# EAGLE design Debugger_1 (EAGLE 9.6.2)
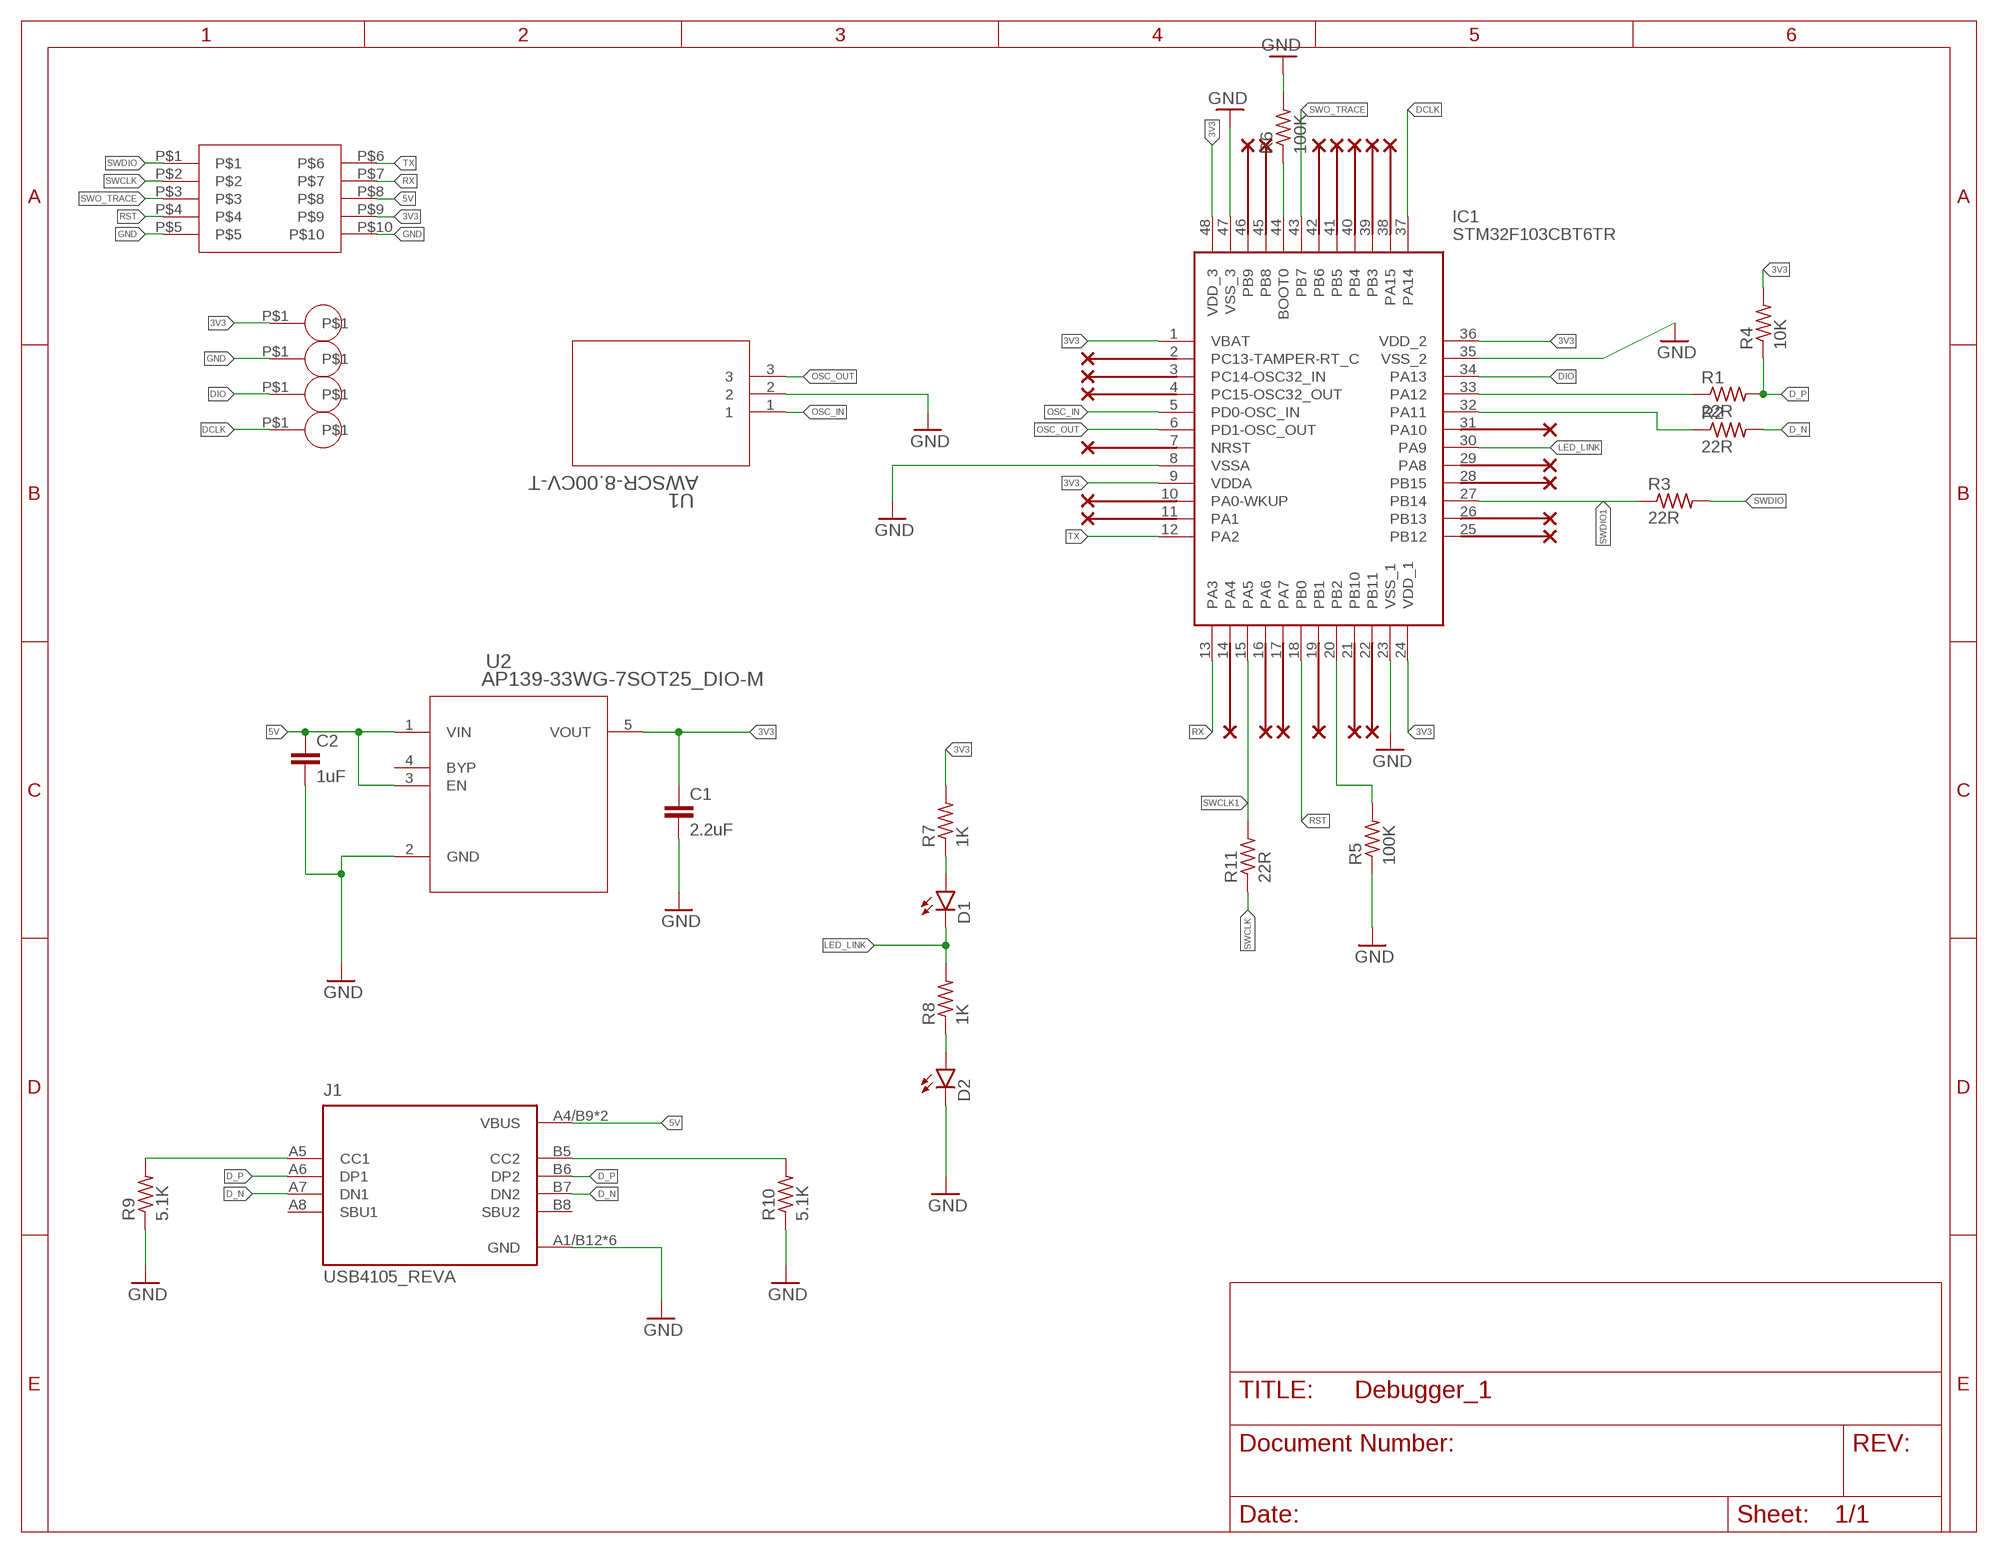
[diagram p0: schematic, sheet 1]

## Parts
C1  2.2uF  C-EUC0603  [C0603]
C2  1uF  C-EUC0603  [C0603]
D1  LEDCHIPLED_0603  [CHIPLED_0603]
D2  LEDCHIPLED_0603  [CHIPLED_0603]
IC1  STM32F103CBT6TR  [QFP50P900X900X160-48N]
J1  USB4105_REVA  [GCT_USB4105_REVA]
R1  22R  R-US_R0603  [R0603]
R2  22R  R-US_R0603  [R0603]
R3  22R  R-US_R0603  [R0603]
R4  10K  R-US_R0603  [R0603]
R5  100K  R-US_R0603  [R0603]
R6  100K  R-US_R0603  [R0603]
R7  1K  R-US_R0603  [R0603]
R8  1K  R-US_R0603  [R0603]
R9  5.1K  R-US_R0603  [R0603]
R10  5.1K  R-US_R0603  [R0603]
R11  22R  R-US_R0603  [R0603]
U1  AWSCR-8.00CV-T  [AWSCR-8.00CV-T_ABR]
U2  AP139-33WG-7SOT25_DIO-M  [SOT25_DIO-M]
U$25  SIDEWAYS_HEADER_10  [SIDEWAYS_HEADER_10]
U$26  SPRING_PAD_1  [SPRING_PAD_1]
U$27  SPRING_PAD_1  [SPRING_PAD_1]
U$28  SPRING_PAD_1  [SPRING_PAD_1]
U$29  SPRING_PAD_1  [SPRING_PAD_1]

## Nets
3V3: C1.1 IC1.1(VBAT) IC1.9(VDDA) IC1.24(VDD_1) IC1.36(VDD_2) IC1.48(VDD_3) R4.2 R7.2 U2.5(VOUT) U$25.P$9 U$26.P$1
5V: C2.1 J1.A4/B9(VBUS) J1.B4/A9(VBUS) U2.1(VIN) U2.3(EN) U$25.P$8
D_N: J1.A7(DN1) J1.B7(DN2) R2.2
D_P: J1.A6(DP1) J1.B6(DP2) R1.2 R4.1
DCLK: IC1.37(PA14) U$29.P$1
DIO: IC1.34(PA13) U$28.P$1
GND: C1.2 C2.2 D2.C IC1.8(VSSA) IC1.23(VSS_1) IC1.35(VSS_2) IC1.47(VSS_3) J1.A1/B12(GND) J1.B1/A12(GND) J1.G1(GND) J1.G2(GND) J1.G3(GND) J1.G4(GND) R5.1 R6.2 R9.1 R10.1 U1.2 U2.2(GND) U$25.P$5 U$25.P$10 U$27.P$1
LED_LINK: D1.C IC1.30(PA9) R8.2
N$1: IC1.20(PB2) R5.2
N$2: IC1.32(PA11) R2.1
N$3: IC1.33(PA12) R1.1
N$4: IC1.44(BOOT0) R6.1
N$5: D1.A R7.1
N$6: J1.A5(CC1) R9.2
N$7: D2.A R8.1
N$9: J1.B5(CC2) R10.2
OSC_IN: IC1.5(PD0-OSC_IN) U1.1
OSC_OUT: IC1.6(PD1-OSC_OUT) U1.3
RST: IC1.18(PB0) U$25.P$4
RX: IC1.13(PA3) U$25.P$7
SWCLK: R11.1 U$25.P$2
SWCLK1: IC1.15(PA5) R11.2
SWDIO: R3.2 U$25.P$1
SWDIO1: IC1.27(PB14) R3.1
SWO_TRACE: IC1.43(PB7) U$25.P$3
TX: IC1.12(PA2) U$25.P$6
Unconnected: IC1.2(PC13-TAMPER-RT_C) IC1.3(PC14-OSC32_IN) IC1.4(PC15-OSC32_OUT) IC1.7(NRST) IC1.10(PA0-WKUP) IC1.11(PA1) IC1.14(PA4) IC1.16(PA6) IC1.17(PA7) IC1.19(PB1) IC1.21(PB10) IC1.22(PB11) IC1.25(PB12) IC1.26(PB13) IC1.28(PB15) IC1.29(PA8) IC1.31(PA10) IC1.38(PA15) IC1.39(PB3) IC1.40(PB4) IC1.41(PB5) IC1.42(PB6) IC1.45(PB8) IC1.46(PB9) J1.A8(SBU1) J1.B8(SBU2) U2.4(BYP)

## Library data of the parts
C1 C2 = rcl:C-EU: CAPACITOR, European symbol; SPICEPREFIX: C
D1 D2 = led:LED: LED OSRAM: - CHIPLED LG R971, LG N971, LY N971, LG Q971, LY Q971, LO R971, LY R971 LH N974, LH R974 LS Q976, LO Q976, LY Q976 LO Q996 - Hyper CHIPLED LW Q18S LB Q993, LB Q99A, LB R99A - SideLED LS A670, LO A670, LY A670, LG A670, LP A670 LB A673, LV A673, LT A673, LW A673 LH A674 LY A675 LS A676, LA A676, LO A676, LY A676, LW A676 LS A679, LY A679, LG A679 - Hyper Micro SIDELED® LS Y876, LA Y876, LO Y876, LY Y876 LT Y87S - SmartLED LW L88C, LW L88S LB L89C, LB L89S, LG L890 LS L89K, LO L89K, LY L89K LS L896, LA L896, LO L896, LY L896 - TOPLED LS T670, LO T670, LY T670, LG T670, LP T670 LSG T670, LSP T670, LSY T670, LOP T670, LYG T670 LG T671, LOG T671, LSG T671 LB T673, LV T673, LT T673, LW T673 LH T674 LS T676, LA T676, LO T676, LY T676, LB T676, LH T676, LSB T676, LW T676 LB T67C, LV T67C, LT T67C, LS T67K, LO T67K, LY T67K, LW E67C LS E67B, LA E67B, LO E67B, LY E67B, LB E67C, LV E67C, LT E67C LW T67C LS T679, LY T679, LG T679 LS T770, LO T770, LY T770, LG T770, LP T770 LB T773, LV T773, LT T773, LW T773 LH T774 LS E675, LA E675, LY E675, LS T675 LS T776, LA T776, LO T776, LY T776, LB T776 LHGB T686 LT T68C, LB T68C - Hyper Mini TOPLED® LB M676 - Mini TOPLED Santana® LG M470 LS M47K, LO M47K, LY M47K Source: http://www.osram.convergy.de LUXEON: - LUMILED® LXK2-PW12-R00, LXK2-PW12-S00, LXK2-PW14-U00, LXK2-PW14-V00 LXK2-PM12-R00, LXK2-PM12-S00, LXK2-PM14-U00 LXK2-PE12-Q00, LXK2-PE12-R00, LXK2-PE12-S00, LXK2-PE14-T00, LXK2-PE14-U00 LXK2-PB12-K00, LXK2-PB12-L00, LXK2-PB12-M00, LXK2-PB14-N00, LXK2-PB14-P00, LXK2-PB14-Q00 LXK2-PR12-L00, LXK2-PR12-M00, LXK2-PR14-Q00, LXK2-PR14-R00 LXK2-PD12-Q00, LXK2-PD12-R00, LXK2-PD12-S00 LXK2-PH12-R00, LXK2-PH12-S00 LXK2-PL12-P00, LXK2-PL12-Q00, LXK2-PL12-R00 Source: www.luxeon.com KINGBRIGHT: KA-3528ASYC Source: www.kingbright.com
IC1 = STM32F103CBT6TR:STM32F103CBT6TR: STMICROELECTRONICS - STM32F103CBT6TR - ARM MCU, STM32 Family STM32F1 Series Microcontrollers, ARM Cortex-M3, 32bit, 72 MHz, 128 KB, 20 KB Source: Datasheet <https://www.st.com/resource/en/datasheet/stm32f103cb.pdf>; ARROW_PART_NUMBER: STM32F103CBT6TR; ARROW_PRICE-STOCK: https://www.arrow.com/en/products/stm32f103cbt6tr/stmicroelectronics; DESCRIPTION: STMICROELECTRONICS - STM32F103CBT6TR - ARM MCU, STM32 Family STM32F1 Series Microcontrollers, ARM Cortex-M3, 32bit, 72 MHz, 128 KB, 20 KB; HEIGHT: 1.6mm; MANUFACTURER_NAME: STMicroelectronics; MANUFACTURER_PART_NUMBER: STM32F103CBT6TR; MOUSER_PART_NUMBER: 511-STM32F103CBT6TR; MOUSER_PRICE-STOCK: https://www.mouser.co.uk/ProductDetail/STMicroelectronics/STM32F103CBT6TR?qs=SU4Xa%252BYHGQr0GBvhN6Y2ig%3D%3D
J1 = USB4105_REVA:USB4105_REVA: USB Type C Receptacle for USB 2.0 SMT Type, PCB Top Mount; DESCRIPTION: USB-C (USB TYPE-C) USB 2.0 Receptacle Connector 24 (16+8 Dummy) Position Surface Mount, Right Angle; Through Hole; MF: Global Connector Technology; MP: USB4105; PACKAGE: Package
R1-R11 = rcl:R-US_: RESISTOR, American symbol; SPICEPREFIX: R
U1 = AWSCR-800CV-T:AWSCR-8.00CV-T; COPYRIGHT: Copyright (C) 2021 Ultra Librarian. All rights reserved.; DIGI-KEY_PART_NUMBER_1: 535-10004-2-ND; DIGI-KEY_PART_NUMBER_2: 535-10004-1-ND; DIGI-KEY_PART_NUMBER_3: 535-10004-6-ND; MANUFACTURER_PART_NUMBER: AWSCR-8.00CV-T; MFR_NAME: Abracon
U2 = AP139-33WG-7:AP139-33WG-7; COPYRIGHT: Copyright (C) 2021 Ultra Librarian. All rights reserved.; DIGI-KEY_PART_NUMBER_1: AP139-33WGCT-ND; DIGI-KEY_PART_NUMBER_2: AP139-33WGDKR-ND; DIGI-KEY_PART_NUMBER_3: AP139-33WGTR-ND; MANUFACTURER_PART_NUMBER: AP139-33WG-7; MFR_NAME: Diodes Inc
U$25 = Sideways_Header_10:SIDEWAYS_HEADER_10
U$26-U$29 = Spring_pad:SPRING_PAD_1

## Board
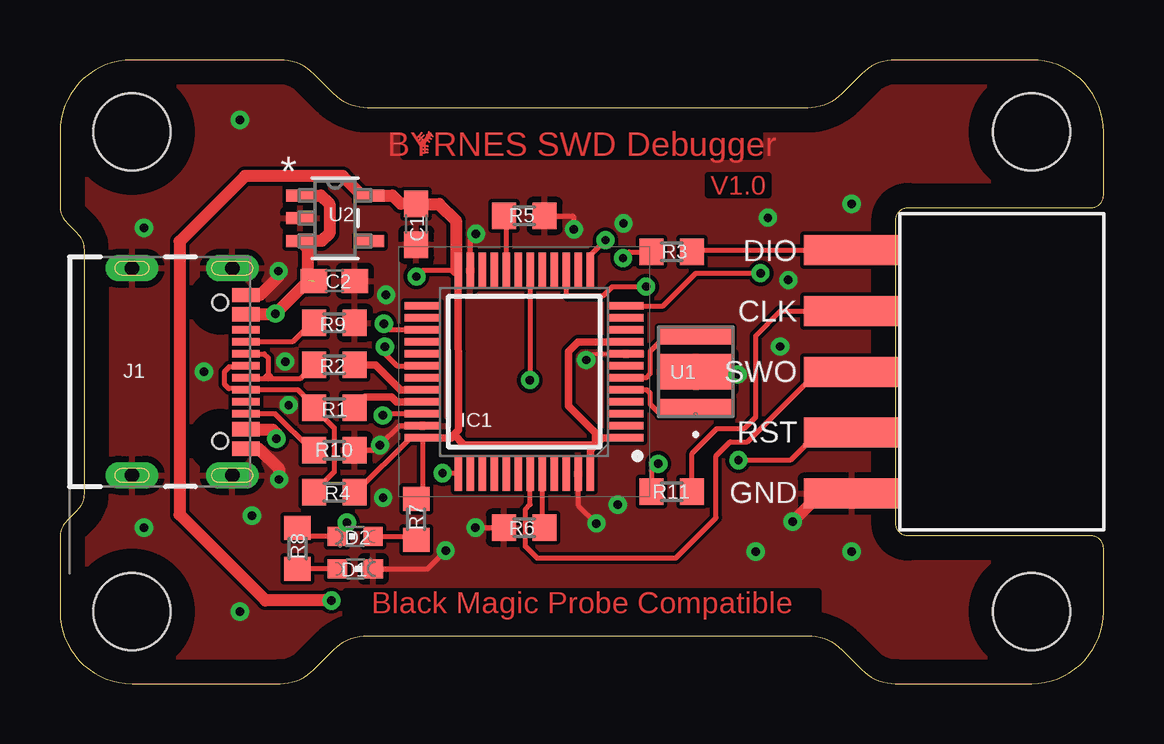
[diagram p1: board, top side]
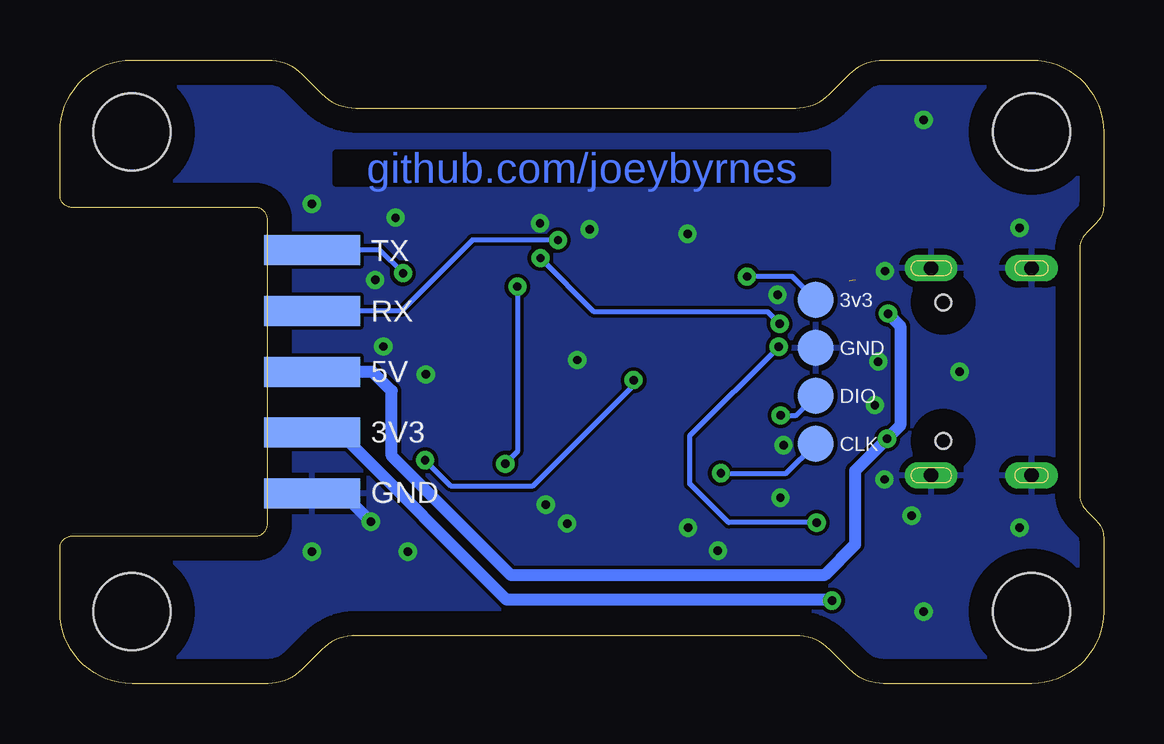
[diagram p2: board, bottom side, seen from below]

Size 43.5 x 26 mm. Coordinates in mm from the lower left corner, seen from the top.
Outline: 43.5,20.35 43.5,23 arc90 40.5,26 34.83,26 arc45 33.41,25.41 32.59,24.59 arc-45 31.17,24 12.83,24 arc-45 11.41,24.59 10.59,25.41 arc45 9.17,26 3,26 arc90 0,23 0,19.91 arc45 0.29,19.21 0.71,18.79 arc-45 1,18.09 1,7.91 arc-45 0.71,7.21 0.29,6.79 arc45 0,6.09 0,3 arc90 3,0 9.17,0 arc45 10.59,0.59 11.41,1.41 arc-45 12.83,2 31.17,2 arc-45 32.59,1.41 33.41,0.59 arc45 34.83,0 40.5,0 arc90 43.5,3 43.5,5.65 arc90 43,6.15 35.35,6.15 arc-90 34.85,6.65 34.85,19.35 arc-90 35.35,19.85 43,19.85 arc90 43.5,20.35
Copper layers (1*16): Top 0.035mm / dielectric 1.5mm / Bottom 0.035mm
Design rules "default *": minimum track width 6mil, minimum drill 0.35mm, track to track 6mil, track to pad 6mil, pad to pad 6mil, via to via 6mil, smd to smd 6mil, copper to edge 40mil, drill to drill 6mil, minimum pad ring 10mil, minimum via ring 8mil, stop-mask expansion 4mil, vias tented up to drill 15mil, thermal gap 10mil
Holes 3.2 mm at 3,23 3,3 40.5,23 40.5,3

### Footprints (pad centres in the part's own frame; a part is rotated, then mirrored left to right if it is on the bottom)
C0603 = smd 1.1 x 1: 1 -0.85,0; 2 0.85,0
CHIPLED_0603 = smd 0.8 x 0.8: A 0,-0.75; C 0,0.75
QFP50P900X900X160-48N = smd 1.475 x 0.3: 1 -4.238,2.75; 2 -4.238,2.25; 3 -4.238,1.75; 4 -4.238,1.25; 5 -4.238,0.75; 6 -4.238,0.25; 7 -4.238,-0.25; 8 -4.238,-0.75; 9 -4.238,-1.25; 10 -4.238,-1.75; 11 -4.238,-2.25; 12 -4.238,-2.75; 25 4.238,-2.75; 26 4.238,-2.25; 27 4.238,-1.75; 28 4.238,-1.25; 29 4.238,-0.75; 30 4.238,-0.25; 31 4.238,0.25; 32 4.238,0.75; 33 4.238,1.25; 34 4.238,1.75; 35 4.238,2.25; 36 4.238,2.75 | smd 0.3 x 1.475: 13 -2.75,-4.238; 14 -2.25,-4.238; 15 -1.75,-4.238; 16 -1.25,-4.238; 17 -0.75,-4.238; 18 -0.25,-4.238; 19 0.25,-4.238; 20 0.75,-4.238; 21 1.25,-4.238; 22 1.75,-4.238; 23 2.25,-4.238; 24 2.75,-4.238; 37 2.75,4.238; 38 2.25,4.238; 39 1.75,4.238; 40 1.25,4.238; 41 0.75,4.238; 42 0.25,4.238; 43 -0.25,4.238; 44 -0.75,4.238; 45 -1.25,4.238; 46 -1.75,4.238; 47 -2.25,4.238; 48 -2.75,4.238
GCT_USB4105_REVA = smd 0.6 x 1.15: A1/B12 -3.2,4.755; A4/B9 -2.4,4.755; B1/A12 3.2,4.755; B4/A9 2.4,4.755 | smd 0.3 x 1.15: A5 -1.25,4.755; A6 -0.25,4.755; A7 0.25,4.755; A8 1.25,4.755; B5 1.75,4.755; B6 0.75,4.755; B7 -0.75,4.755; B8 -1.75,4.755 | drill 0.6 pad 1 long: G1 -4.32,0; G2 4.32,0 | drill 0.6 pad 1.05 long: G3 -4.32,4.18; G4 4.32,4.18 | hole 0.65: 2.89,3.68; -2.89,3.68
R0603 = smd 1 x 1.1: 1 -0.85,0; 2 0.85,0
AWSCR-8.00CV-T_ABR = smd 0.711 x 3.099: 1 -1.5,0; 3 1.5,0 | smd 1.499 x 3.099: 2 0,0
SOT25_DIO-M = smd 1.2 x 0.5: 1 -1.45,0.95; 2 -1.45,0; 3 -1.45,-0.95; 4 1.45,-0.95; 5 1.45,0.95
SIDEWAYS_HEADER_10 = smd 4 x 1.25: P$1 0,5.08; P$2 0,2.54; P$3 0,0; P$4 0,-2.54; P$5 0,-5.08 | smd 4 x 1.25 bottom: P$6 0,5.08; P$7 0,2.54; P$8 0,0; P$9 0,-2.54; P$10 0,-5.08
SPRING_PAD_1 = smd 1.5 x 1.5: P$1 0,0

### Placement (x,y rotation side)
C1  14.85,19.15 270 top
C2  11.44,16.79 0 top
D1  12.3,6.13 90 top
D2  12.31,4.78 270 top
IC1  19.35,13 180 top
J1  3,13 270 top
R1  11.44,11.5 180 top
R2  11.44,13.29 180 top
R3  25.5,18 0 top
R4  11.44,7.98 0 top
R5  19.35,19.5 180 top
R6  19.35,6.5 180 top
R7  14.85,6.85 90 top
R8  9.9,5.63 90 top
R9  11.44,15.04 180 top
R10  11.44,9.73 180 top
R11  25.5,8 180 top
U1  26.5,13 90 top
U2  11.47,19.4 0 top
U$25  33,13 0 top
U$26  12,16 0 bottom
U$27  12,14 0 bottom
U$28  12,12 0 bottom
U$29  12,10 0 bottom

### Tracks (layer width: path | path; a pad name or v marks a point on that pad's centre or on a via)
3V3  (via drill 0.35)
  Top 0.203: R4.2 12.34,7.98 14.61,10.25 IC1.36 15.11,7.96 R7.2 | v14.86,16.97 15.13,17.24 16.5,17.24
  Top 0.305: 16.5,17.24 IC1.24 16.61,10.57 16.42,10.38 | IC1.36 16.32,10.25 16.32,10.28 16.42,10.38 | IC1.1 22.61,10.25 22.53,10.25 22.33,10.45 | IC1.48 22.11,9.73 22.33,9.95 | 22.58,10.2 22.33,9.95 | 16.42,10.38 16.85,9.95 22.33,9.95 | IC1.9 21.6,14.25 21.2,13.85 21.2,11.58 22.33,10.45 | 22.33,9.95 22.33,10.45
  Top 0.508: 16.5,17.24 16.5,19.31 15.81,20 C1.1 14.2,20.01 13.86,20.35 U2.5 12.6,20.35 11.79,21.16 7.71,21.16 4.98,18.43 4.98,7.05 8.56,3.46 v11.31,3.46 v11.32,3.46
  Bottom 0.203: U$26.P$1 12.97,16.97 v14.86,16.97
  Bottom 0.508: v11.32,3.46 11.37,3.5 24.88,3.5 31.84,10.46 U$25.P$9
5V  (via drill 0.35)  (1 unrouted)
  Top 0.203: C2.1 10.33,16.79
  Top 0.508: J1.A4/B9 8.71,15.4 8.91,15.38 v8.98,15.42 10.34,16.78 10.34,16.82 | 10.33,16.79 10.33,18.14 U2.3 10.91,18.45 11.23,18.77 11.23,19.99 10.87,20.35 U2.1 | J1.B4/A9 7.78,10.58 8.87,10.58 9.02,10.43 v9.02,10.21
  Bottom 0.508: v8.98,15.42 8.47,14.91 8.47,10.76 v9.02,10.21 10.36,8.87 10.36,5.8 11.64,4.52 24.69,4.52 29.67,9.5 29.67,12.2 30.47,13 U$25.P$8
D_N
  Top 0.203: R2.2 10,12.7 8.87,12.7 | 8.87,12.7 8.74,12.7 | 8.74,12.7 8.69,12.7 | 8.69,12.7 8.03,12.7 J1.A7 | 8.69,12.7 8.53,12.73 8.68,12.88 | J1.B7 8.52,13.75 8.68,13.59 8.68,12.88 | 8.68,12.88 8.68,12.76 8.74,12.7 | 8.68,12.88 8.69,12.88 8.87,12.7
D_P
  Top 0.203: J1.A6 7.71,13.2 7.05,13.2 6.85,13 6.85,12.48 7.04,12.3 7.71,12.3 J1.B6 9.92,12.25 10.59,11.58 R1.2 11.43,10.66 11.43,8.82 R4.1
DCLK  (via drill 0.35)
  Top 0.203: IC1.37 v15.96,8.76 v15.95,8.77
  Bottom 0.203: v15.95,8.77 13.23,8.77 U$29.P$1
DIO  (via drill 0.35)
  Top 0.203: IC1.34 13.53,11.25 v13.46,11.18
  Bottom 0.203: v13.46,11.18 12.82,11.18 U$28.P$1
GND  (via drill 0.35)
  Top 0.152: IC1.8 22.2,13.75 v21.94,13.49
  Top 0.203: D2.C 15.32,4.78 v16.08,5.54 | IC1.47 21.6,7.43 v22.36,6.67 | R6.2 v17.32,6.5 | R10.1 13.13,9.73 v13.34,9.94 14.15,10.75 IC1.35 | v17.34,18.75 17.1,18.51 IC1.23 | v21.42,18.94 21.42,19.46 21.38,19.5 R5.1
  Top 0.508: J1.B1/A12 8.29,9.8 9.13,8.96 v9.13,8.51 | 8.09,16.2 J1.A1/B12 8.35,16.2 9.11,16.96 v9.11,17.2 | U$25.P$10 31.71,7.92 v30.54,6.75
  Bottom 0.508: v30.54,6.75 31.71,7.92 U$25.P$10
  other vias: 28.25,12.89 7.5,3 3.5,6.5 3.5,19 7.5,23.5 23.49,19.19 29.51,19.42 33,20 33,5.5 29,5.5 23.25,7.46 13.47,7.75 8,7 13.59,16.21 30.02,14.05 6,13 9.39,13.42 9.53,11.61 30.36,16.83
  pour Top (rank 5): -1,27.25 43.5,27.25 47,23.75 47,-0.25 45,-2.25 0,-2.25 -1.75,-0.5 -1.75,26.5
  pour Bottom (rank 5): -0.25,26.75 44.25,26.75 47.75,23.25 47.75,-0.75 45.75,-2.75 0.75,-2.75 -1,-1 -1,26
LED_LINK  (via drill 0.35)
  Top 0.203: R8.2 10.25,6.13 D1.C 11.96,6.54 v11.96,6.71 | v13.54,14.04 13.54,13.76 14.05,13.25 IC1.30
  Bottom 0.203: v11.96,6.71 15.63,6.71 17.24,8.32 17.24,10.34 v13.54,14.04
N$1
  Top 0.203: R5.2 18.6,19.4 IC1.20
N$2
  Top 0.305: R2.1 13.15,13.29 14.19,12.25 IC1.32
N$3
  Top 0.305: IC1.33 14.02,11.75 13.82,11.95 12.74,11.95 R1.1
N$4
  Top 0.203: IC1.44 20.1,6.6 R6.1
N$5
  Top 0.203: R7.1 14.53,6.03 14.65,6.03 14.55,6.13 D1.A
N$6
  Top 0.203: R9.2 10.48,15.04 9.69,14.25 J1.A5
N$7
  Top 0.203: D2.A R8.1
N$8
  Top 0.076: 15.09,22.14 15.22,22.14 | 15.33,22.14 15.22,22.14 | 15.22,22.14 15.21,22.15 15.21,22.26 | 15.21,22.26 15.08,22.26 | 15.34,22.26 15.21,22.26 | 15.21,22.26 15.21,22.38 15.19,22.4 | 15.19,22.4 15.08,22.4 | 15.19,22.4 15.21,22.4 | 15.34,22.4 15.21,22.4 | 15.21,22.4 15.21,22.54 15.12,22.63 | 15.05,22.56 15.12,22.63 | 15.12,22.63 15.12,22.67 15.08,22.71 15.02,22.71 | 15.02,22.71 14.97,22.66 | 15.02,22.71 15.08,22.77 | 15.16,22.85 15.08,22.77 | 15.08,22.77 15.04,22.77 14.97,22.84 | 14.97,22.84 14.97,22.85 | 14.97,22.85 14.89,22.77 | 15.08,22.96 14.97,22.85 | 14.97,22.84 14.97,22.83 15.19,22.61 15.19,22.53 15.31,22.65 15.31,22.67 15.32,22.66 | 15.39,22.59 15.32,22.66 | 15.32,22.66 15.32,22.7 15.37,22.75 | 15.37,22.75 15.39,22.77 15.3,22.87 | 15.37,22.75 15.38,22.75 15.39,22.76 15.41,22.76 | 15.41,22.76 15.47,22.7 | 15.41,22.76 15.4,22.77 15.4,22.8 15.45,22.85 15.45,22.88 15.44,22.89 15.47,22.89 | 15.37,22.99 15.47,22.89 | 15.47,22.89 15.55,22.81
N$9
  Top 0.203: R10.2 10.49,9.73 8.97,11.25 J1.B5
OSC_IN
  Top 0.203: IC1.5 24.45,12.26 24.6,12.11 24.6,11.65 25.02,11.23 26.31,11.23 U1.1
OSC_OUT
  Top 0.203: U1.3 26.52,14.44 25.19,14.44 24.6,13.85 24.6,12.92 24.43,12.75 IC1.6
RST  (via drill 0.35)
  Top 0.203: IC1.18 v19.6,12.66 v19.59,12.65 | v28.28,9.31 30.44,9.31 31.59,10.46 U$25.P$4
  Bottom 0.203: v19.59,12.65 19.59,12.43 23.77,8.25 27.22,8.25 v28.28,9.31
RX  (via drill 0.35)
  Top 0.203: IC1.13 22.1,17.81 22.08,17.83 v22.74,18.49
  Bottom 0.203: v22.74,18.49 26.31,18.49 29.26,15.54 U$25.P$7
SWCLK
  Top 0.203: R11.1 26.35,9.6 27.37,10.62 28.5,10.62 29,11.12 29,14.5 30.04,15.54 U$25.P$2
SWCLK1  (via drill 0.35)
  Top 0.203: IC1.15 21.1,16.26 21.19,16.17 22.65,16.17 23.03,16.55 v24.43,16.55 | v24.94,9.16 24.65,8.87 R11.2
  Bottom 0.203: v24.43,16.55 24.43,9.67 v24.94,9.16
SWDIO
  Top 0.203: R3.2 26.43,18.08 U$25.P$1
SWDIO1  (via drill 0.35)
  Top 0.203: IC1.27 13.75,14.75 v13.5,15 | v23.47,17.74 23.73,18 R3.1
  Bottom 0.203: v13.5,15 14,15.5 21.23,15.5 v23.47,17.74
SWO_TRACE
  Top 0.203: IC1.43 19.6,7.46 19.4,7.26 19.4,5.71 19.88,5.23 25.67,5.23 27.35,6.91 27.35,9.49 27.93,10.07 28.65,10.07 31.57,13 U$25.P$3
TX  (via drill 0.35)
  Top 0.203: IC1.12 25.14,15.75 26.5,17.11 v29.2,17.11
  Bottom 0.203: v29.2,17.11 30.17,18.08 U$25.P$6

### Text on the board
Top: BYRNES SWD Debugger | V1.0 | Black Magic Probe Compatible
Bottom: github.com/joeybyrnes
tPlace: DIO / CLK / SWO / RST / GND
bPlace: 3v3 | GND | TX / RX / 5V / 3V3 / GND | DIO | CLK
tStop: BYRNES SWD Debugger | V1.0 | Black Magic Probe Compatible
bStop: github.com/joeybyrnes